# EasyEDA Pro project ProPrj_100MHz��ѹ���̽ͷ_2024-07-25.epro, board 高压差分探头_PLUS_V8.1
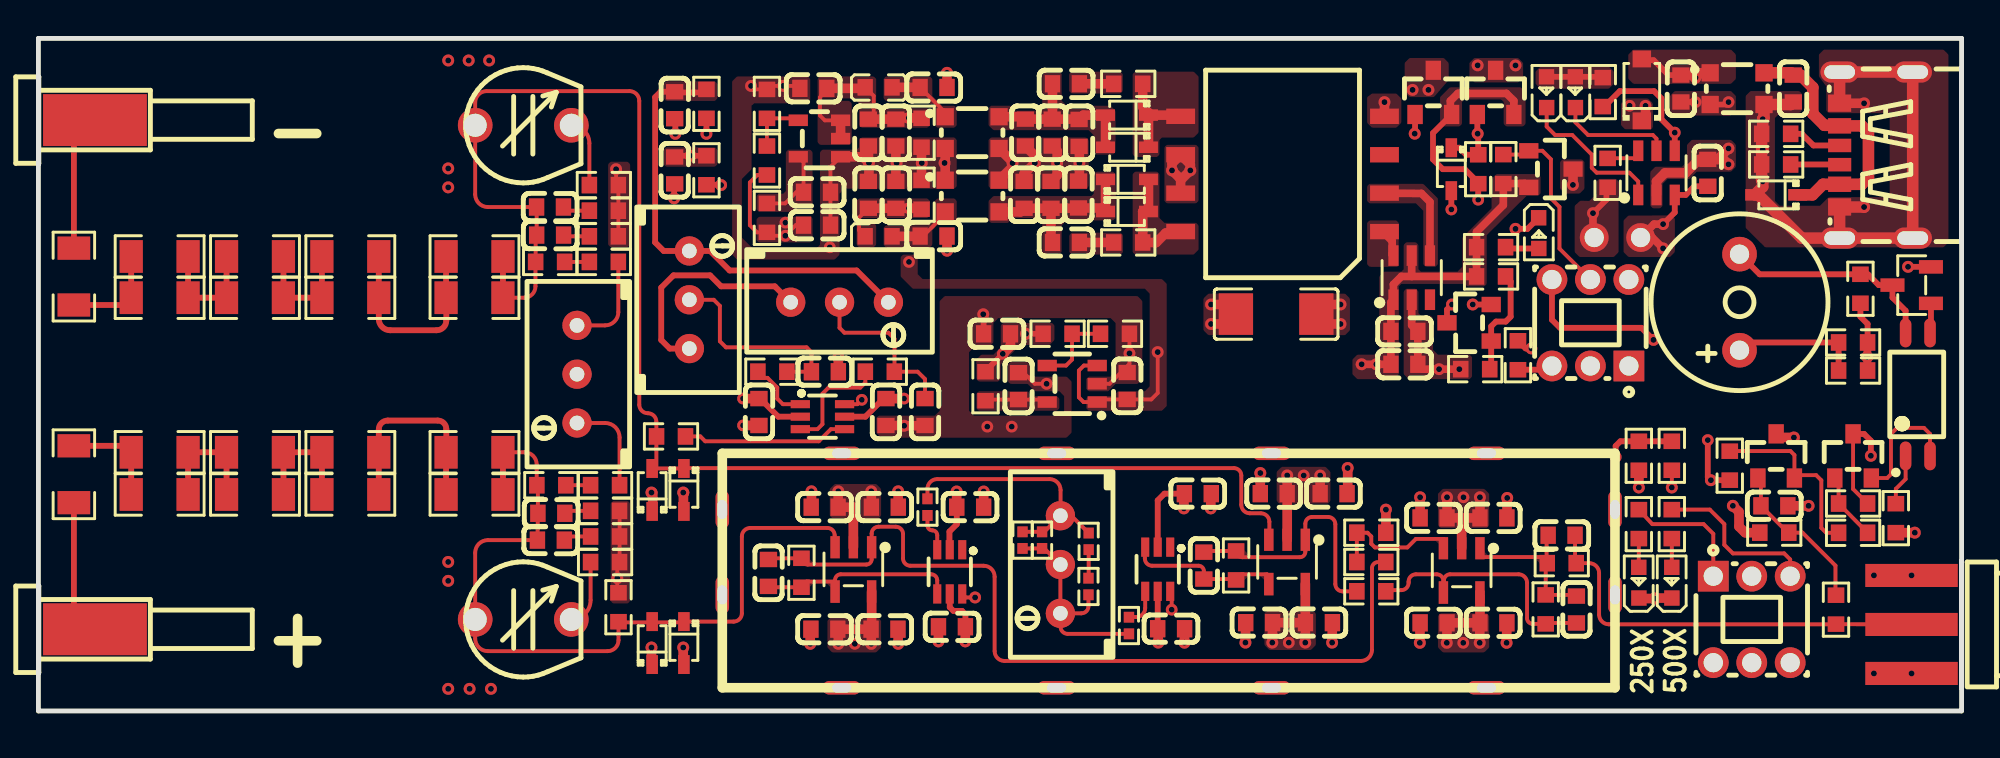
[diagram p12: board, top side]
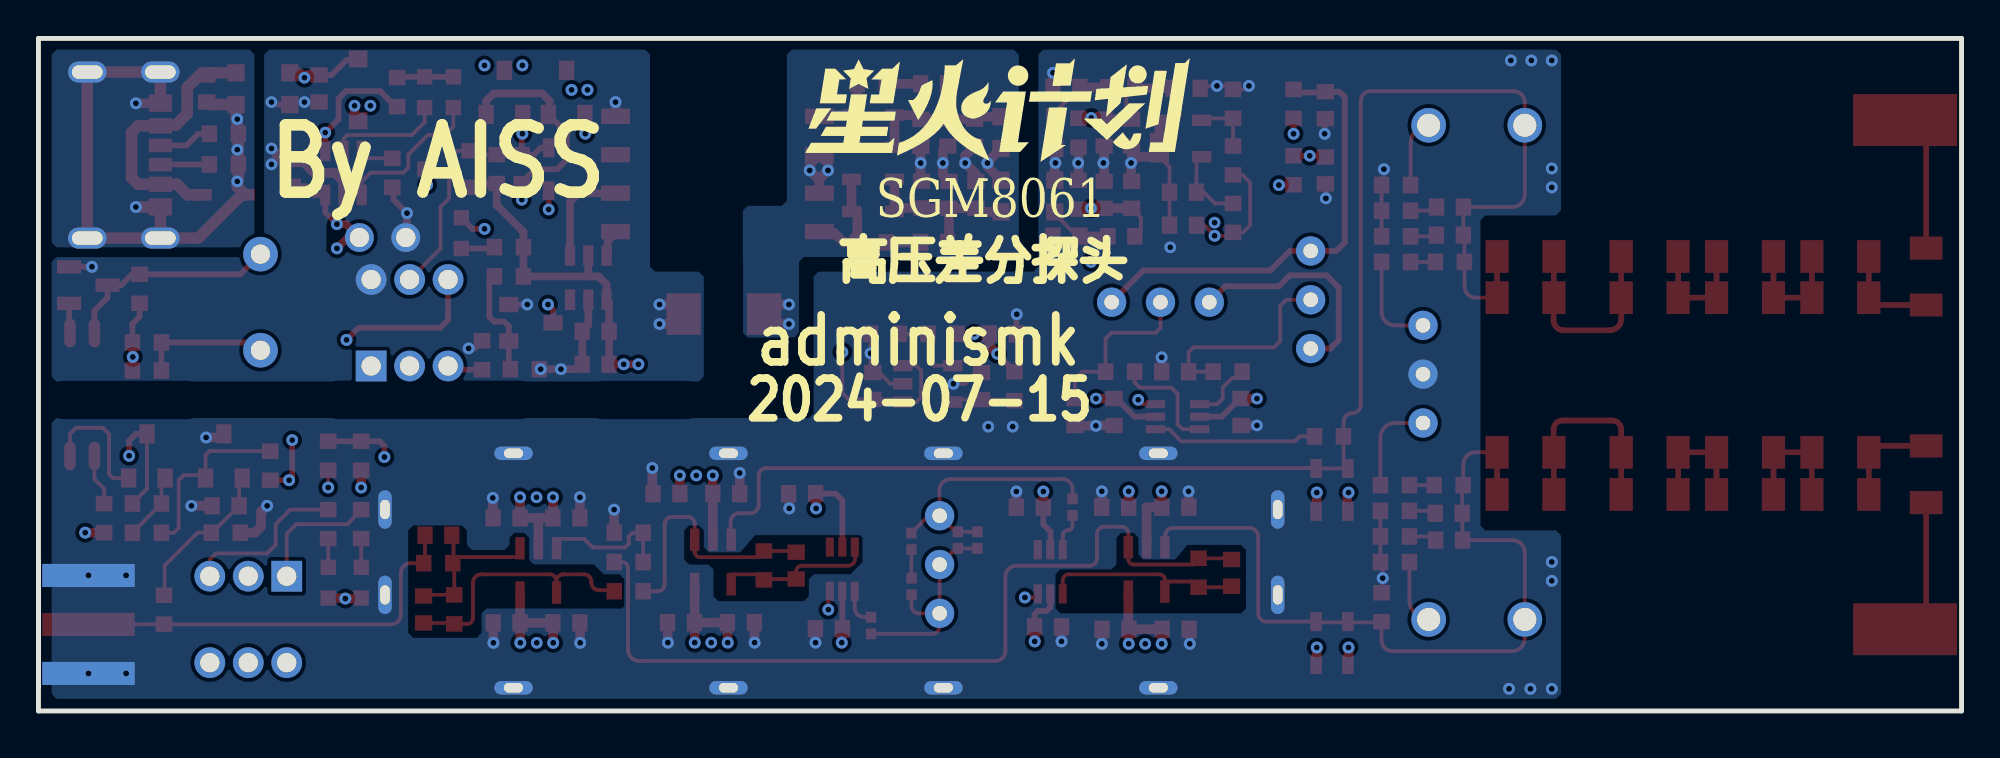
[diagram p13: board, bottom side, seen from below]

Outline 100 x 35 mm; copper layers: Top Layer, Inner1, Inner2, Bottom Layer. Coordinates in mm from the lower left corner of the outline.
Outline path: 0,35 100,35 100,0 0,0 0,35
Stack: Top Layer 0.035mm / Dielectric1 0.48mm PP er 4.5 / Inner1 0.035mm / Dielectric2 0.48mm FR4 er 4.5 / Inner2 0.035mm / Dielectric3 0.48mm PP er 4.5 / Bottom Layer 0.035mm

## Design rules (mm)
template: 用户自定义配置
spacing Default (default): track to track 0.18, other pairs 0 to 0.18
track width Default (default): min 0.099, default 0.099, max 25.4
differential pair differentialPair (default): width min 0.127, default 0.254, max 2.54; gap min 0.152, default 0.152
via Default (default): diameter min 0.61, default 0.61, max 100.025; hole min 0.305, default 0.305, max 59.995
pour e168 uses gge36621

## Placement (name value [footprint] x y rotation side)
BZ1  3kHz  [BUZ-TH_BD9.0-P5.00-D0.6-FD]  88.46 21.27 90 top
C1  22uF  [C0603]  52.65 26.86 270 top
C2  22uF  [C0603]  51.25 26.86 270 top
C3  1uF  [C0603]  44 4.25 180 top
C4  100nF  [C0603]  54.08 26.88 90 top
C5  22uF  [C0603]  43.16 30.1 90 top
C7  22uF  [C0603]  51.32 30.1 90 top
C8  22uF  [C0603]  52.71 30.1 90 top
C9  100nF  [C0603]  40.87 4.25 180 top
C10  10uF  [C0603]  56.61 16.91 270 top
C11  10uF  [C0603]  50.96 16.9 270 top
C12  10uF  [C0603]  49.85 19.63 0 top
C13  100nF  [C0603]  86.8 28 90 top
C14  1nF  [C0603]  53.43 24.38 180 top
C15  10uF  [C0603]  40.29 32.4 0 top
C16  10uF  [C0603]  40.48 27 180 top
C17  10uF  [C0603]  40.48 25.28 180 top
C18  100nF  [C0603]  54.11 30.08 270 top
C19  1nF  [C0603]  53.43 32.64 180 top
C20  10uF  [C0603]  71.03 18.04 180 top
C21  10uF  [C0603]  71.03 19.76 180 top
C22  100nF  [C0603]  33.08 31.52 270 top
C23  100nF  [C0603]  33.08 28.13 270 top
C24  4.7pF  [R1206]  6.3 21.51 180 top
C25  4.7pF  [R1206]  11.26 21.51 180 top
C26  4.7pF  [R1206]  16.22 21.51 180 top
C27  2.2pF  [R1206]  22.67 21.51 180 top
C28  10uF  [C0603]  85.41 32.39 90 top
C29  100nF  [C0603]  40.89 17.65 0 top
C30  100pF  [C0603]  26.61 24.77 180 top
C31  100pF  [C0603]  26.6 26.23 180 top
C32  120pF  [CAP-TH_JML06]  25.21 30.48 0 top
C33  820pF  [C0603]  37.96 7.18 270 top
C34  100pF  [R0402]  51.17 8.89 90 top
C35  NC  [C0603]  79.97 5.28 270 top
C36  220pF  [C0603]  60.6 7.56 270 top
C37  100pF  [C0603]  26.67 10.29 0 top
C38  100pF  [C0603]  26.65 8.89 0 top
C39  120pF  [CAP-TH_JML06]  25.21 4.76 0 top
C40  4.7pF  [R1206]  6.3 13.46 180 top
C41  4.7pF  [R1206]  11.26 13.46 180 top
C42  4.7pF  [R1206]  16.22 13.46 180 top
C43  2.2pF  [R1206]  22.67 13.46 180 top
C44  22pF  [C0603]  79.2 9.14 180 top
C45  2.2pF  [C0603]  90.27 10.68 0 top
C46  1uF  [C0603]  63.48 4.6 0 top
C47  1uF  [C0603]  72.55 4.58 0 top
C48  100nF  [C0603]  66.59 4.6 0 top
C49  100nF  [C0603]  75.66 4.58 0 top
C50  100nF  [C0603]  75.66 10.05 0 top
C51  100nF  [C0603]  67.35 11.31 0 top
C52  1uF  [C0603]  72.55 10.05 0 top
C53  1uF  [C0603]  64.24 11.31 0 top
C54  100nF  [C0603]  44.01 10.6 0 top
C55  1uF  [C0603]  40.88 10.6 0 top
C56  100nF  [C0603]  47.5 4.38 180 top
C57  100nF  [C0603]  48.45 10.6 0 top
C59  22uF  [C0603]  44.59 30.1 90 top
C60  22uF  [C0603]  43.15 26.86 270 top
C61  22uF  [C0603]  44.59 26.86 270 top
C62  100nF  [C0603]  58.9 4.28 0 top
C63  100nF  [C0603]  60.29 11.31 0 top
C64  100nF  [C0603]  44.07 15.56 270 top
C65  100nF  [C0603]  37.47 15.56 270 top
C66  100nF  [C0603]  46.1 15.56 270 top
C67  10uF  [C0603]  91.25 32.39 90 top
C68  22uF  [C0603]  46.55 32.45 180 top
C69  22uF  [C0603]  46.55 24.71 180 top
C70  47pF  [R0402]  54.6 6.48 90 top
D1  PESD5V0S1BA  [SOD-323_L1.7-W1.3-LS2.5-FD-1]  90.36 26.86 0 top
D2  B0520LW  [SOD-123_L2.7-W1.6-LS3.7-RD-4]  83.38 32.32 90 top
D3  B5819WS  [SOD-323_L1.7-W1.3-LS2.5-FD-1]  56.6 27.66 180 top
D4  B5819WS  [SOD-323_L1.7-W1.3-LS2.5-FD-1]  56.6 25.99 180 top
D5  B5819WS  [SOD-323_L1.7-W1.3-LS2.5-FD-1]  73.47 28.19 90 top
D6  B5819WS  [SOD-323_L1.7-W1.3-LS2.5-FD-1]  56.6 31.01 0 top
D7  B5819WS  [SOD-323_L1.7-W1.3-LS2.5-FD-1]  56.6 29.34 0 top
D8  1N4148WS  [SOD-323_L1.7-W1.3-LS2.5-FD-1]  31.91 11.5 270 top
D9  1N4148WS  [SOD-323_L1.7-W1.3-LS2.5-FD-1]  33.56 11.5 90 top
D10  1N4148WS  [SOD-323_L1.7-W1.3-LS2.5-FD-1]  31.91 3.53 270 top
D11  1N4148WS  [SOD-323_L1.7-W1.3-LS2.5-FD-1]  33.56 3.53 90 top
L1  2KΩ  [L0603]  43.69 24.7 180 top
L2  2KΩ  [L0603]  43.69 32.45 180 top
L3  WCM3225F2SF-601T10  [FILTER-SMD_4P-L3.2-W2.5-TL_PCAQ3225A]  88.33 32.39 0 top
L4  WCM3225F2SF-601T10  [FILTER-SMD_4P-L3.2-W2.5-TL_PCAQ3225A]  48.55 26.8 0 top
L5  WCM3225F2SF-601T10  [FILTER-SMD_4P-L3.2-W2.5-TL_PCAQ3225A]  48.55 30.1 0 top
LED1  GREEN  [LED0603-RD_GREEN]  83.22 6.67 90 top
LED2  BLUE  [LED0603-RD]  84.93 6.67 90 top
NOREF  -  [Pad_e7413]  52.94 1.21 0 top
NOREF#2  -  [Pad_e7016]  83.31 24.64 0 top
NOREF#3  -  [Pad_e6879]  52.94 13.41 0 top
NOREF#4  -  [Pad_e6880]  64.12 13.41 0 top
NOREF#5  -  [Pad_e6653]  35.56 10.48 90 top
NOREF#6  -  [Pad_e7151]  75.3 1.21 0 top
NOREF#7  -  [Pad_e7015]  80.9 24.64 0 top
NOREF#8  -  [Pad_e6485]  41.77 1.21 0 top
NOREF#9  -  [Pad_e6514]  41.77 13.41 0 top
NOREF#10  -  [Pad_e7414]  64.12 1.21 0 top
NOREF#11  -  [Pad_e7073]  81.98 10.48 90 top
NOREF#12  -  [Pad_e7037]  81.98 6.04 90 top
NOREF#13  -  [Pad_e7178]  75.3 13.41 0 top
NOREF#14  -  [Pad_e6603]  35.56 6.04 90 top
Q1  SS8050  [SOT-23_L2.9-W1.3-P1.90-LS2.4-BR]  74.39 20.2 0 top
Q2  AO3401A  [SOT-23_L2.9-W1.3-P1.90-LS2.4-BR]  72.53 32.19 270 top
Q3  AO3401A  [SOT-23_L2.9-W1.3-P1.90-LS2.4-BR]  75.77 32.19 270 top
Q4  SS8050  [SOT-23-3_L2.9-W1.3-P1.90-LS2.4-BR]  97.41 22.16 0 top
Q5  S8550  [SOT-23_L2.9-W1.3-P1.90-LS2.4-BR]  94.36 13.27 270 top
Q6  AO3401A  [SOT-23_L2.9-W1.3-P1.90-LS2.4-BR]  78.65 28.2 180 top
R1  1kΩ  [R0603]  75.54 24.14 0 top
R2  330Ω  [R0603]  45.92 26.87 270 top
R3  330Ω  [R0603]  45.92 30.09 90 top
R4  100kΩ  [R0603]  76.17 28.2 270 top
R5  47kΩ  [R0603]  76.93 18.51 270 top
R6  27kΩ  [R0603]  75.54 22.61 180 top
R10  5.1kΩ  [R0603]  90.36 30.04 0 top
R11  5.1kΩ  [R0603]  90.36 28.44 0 top
R12  4.7kΩ  [R0603]  74.71 17.79 0 top
R15  0Ω  [R0603]  49.25 16.9 90 top
R17  120kΩ  [R0603]  52.99 19.63 180 top
R18  110kΩ  [R0603]  55.98 19.63 0 top
R19  4.7kΩ  [R0603]  81.6 28 90 top
R20  100kΩ  [R0603]  74.87 28.19 90 top
R21  22Ω  [R0603]  56.67 24.38 180 top
R23  120kΩ  [R0603]  37.88 28.65 270 top
R24  110kΩ  [R0603]  37.88 31.59 90 top
R27  0Ω  [R0603]  37.88 25.66 270 top
R28  22Ω  [R0603]  56.67 32.64 180 top
R31  10KΩ  [RES-ADJ-TH_3296W]  33.85 21.4 0 top
R33  10kΩ  [R0603]  90.26 9.28 0 top
R34  10kΩ  [R0603]  38.16 17.66 0 top
R35  1MΩ  [R1206]  6.3 23.65 0 top
R36  1MΩ  [R1206]  11.26 23.65 0 top
R37  1MΩ  [R1206]  16.22 23.65 0 top
R38  1MΩ  [R1206]  22.67 23.65 0 top
R39  7.5kΩ  [R0603]  26.61 23.37 180 top
R40  402Ω  [R0603]  69.31 9.28 0 top
R41  402Ω  [R0603]  39.67 7.19 90 top
R42  402Ω  [R0603]  29.4 23.37 180 top
R43  10Ω  [R0603]  29.4 24.7 180 top
R44  10Ω  [R0603]  29.4 26.03 180 top
R45  10Ω  [R0603]  29.4 27.37 180 top
R46  402Ω  [R0603]  69.31 7.75 180 top
R47  50Ω  [R0603]  79.21 7.69 0 top
R48  200Ω  [RES-ADJ-TH_3296W]  28 17.53 180 top
R49  402Ω  [R0603]  69.31 6.23 0 top
R50  3.3kΩ  [R0402]  52.19 8.89 270 top
R52  402Ω  [R0603]  29.46 11.75 0 top
R53  10Ω  [R0603]  29.46 10.41 0 top
R54  10Ω  [R0603]  29.46 9.08 0 top
R55  10Ω  [R0603]  29.46 7.75 0 top
R56  402Ω  [R0603]  62.28 7.57 90 top
R57  20KΩ  [RES-ADJ-TH_3296W]  53.14 7.62 180 top
R58  402Ω  [R0603]  78.38 5.29 90 top
R59  7.5kΩ  [R0603]  26.67 11.75 0 top
R60  NC  [R0603]  30.16 5.4 90 top
R62  1MΩ  [R1206]  6.3 11.27 0 top
R63  1MΩ  [R1206]  11.26 11.27 0 top
R64  1MΩ  [R1206]  16.22 11.27 0 top
R65  1MΩ  [R1206]  22.67 11.27 0 top
R67  2.2kΩ  [R0603]  94.74 21.97 270 top
R68  2.2kΩ  [R0603]  96.58 10.03 270 top
R69  1kΩ  [R0603]  87.95 12.76 270 top
R70  2.2kΩ  [R0603]  83.22 9.72 270 top
R71  1kΩ  [R0603]  94.36 9.27 180 top
R72  2.2kΩ  [R0603]  84.93 9.72 270 top
R73  2.2kΩ  [R0603]  84.93 13.28 270 top
R74  7.5kΩ  [R0603]  93.47 5.27 90 top
R75  2.2kΩ  [R0603]  83.22 13.28 90 top
R76  18kΩ  [R0603]  94.36 10.8 180 top
R77  330kΩ  [R0603]  32.89 14.29 180 top
R78  10KΩ  [RES-ADJ-TH_3296W]  41.66 21.27 270 top
R79  10kΩ  [R0603]  43.75 17.66 0 top
R80  22Ω  [R0603]  34.73 28.14 90 top
R81  22Ω  [R0603]  34.73 31.59 90 top
R82  1kΩ  [R1206]  1.84 22.61 270 top
R83  1kΩ  [R1206]  1.84 12.32 90 top
R84  100Ω  [R0402]  54.61 8.83 270 top
R85  10Ω  [R0402]  46.23 10.61 90 top
R86  10Ω  [R0402]  56.71 4.44 90 top
RF1  BWSMA-KE-P001  [SMA-SMD_BWSMA-KE-P001]  97.4 4.5 0 top
SW1  TK-6580-1  [SW-TH_TK-6580-1]  80.7 20.2 270 top
SW2  TK-6580-1  [SW-TH_TK-6580-1]  89.09 4.76 90 top
U2  BLUE  [LED0603-RD]  78.01 24.87 270 top
U5  1kΩ  [R0603]  81.34 32.21 90 top
U6  RED  [LED0603-RD]  78.42 32.2 90 top
U7  TP4057  [SOT-23-6_L2.9-W1.6-P0.95-LS2.8-BL]  84.14 28 0 top
U8  GREED  [LED0603-RD]  79.92 32.2 90 top
U9  ME6211C25M5G-N  [SOT-23-5_L3.0-W1.7-P0.95-LS2.8-BR]  53.76 17.03 0 top
U10  SGM2209-ADJXN5G/TR  [SOT-23-5_L2.9-W1.6-P0.95-LS2.8-BL]  40.61 29.79 90 top
U11  EPC10  [XFMR-SMD_8P-L10.8-W7.9-P2.00_EPC10]  64.69 27.95 0 top
U14  1nF  [C1808]  64.36 20.65 0 top
U15  SGM8061XN5/TR  [SOT-23-5_L3.0-W1.7-P0.95-LS2.8-BL]  42.38 7.37 180 top
U16  SGM8061XN5/TR  [SOT-23-5_L3.0-W1.7-P0.95-LS2.8-BL]  74.01 7.32 180 top
U17  SGM8061XN5/TR  [SOT-23-5_L3.0-W1.7-P0.95-LS2.8-BL]  64.93 7.75 180 top
U18  200Ω  [R0603]  94.36 19.18 0 top
U19  200Ω  [R0603]  94.36 17.72 0 top
U20  JC3H7C  [OPTO-SMD-4_L4.4-W2.7-P1.27-LS7.0-BR]  97.73 16.47 270 top
U21  BL1551B  [SC-70-6_L2.1-W1.3-P0.65-LS2.3-BR]  47.39 7.24 90 top
U22  TL432  [SOT-23_L2.9-W1.3-P1.90-LS2.4-BR]  90.36 13.27 270 top
U23  VPS8702  [SOT-23-6_L2.9-W1.6-P0.95-LS2.8-BL]  71.41 22.55 0 top
U24  2mm香蕉头  [2MM香蕉头母座]  4.97 30.75 0 top
U25  2mm香蕉头  [2MM香蕉头母座]  4.97 4.25 0 top
U26  BL1551B  [SC-70-6_L2.1-W1.3-P0.65-LS2.3-BR]  58.2 7.37 90 top
U27  BL1551B  [SC-70-6_L2.1-W1.3-P0.65-LS2.3-BR]  40.77 15.31 180 top
USBC1  USB 3.1 C 6PF  [USB-C-SMD_TYPE-C-USB-13]  95.56 28.93 90 top

## Footprints (pads in the part's own frame, mm; a bottom-side part is the same pattern mirrored in y, then rotated)
2MM香蕉头母座
  rect 5.4x2.7 smd: 1(-2.032,0)
BUZ-TH_BD9.0-P5.00-D0.6-FD
  round 1.8 hole 1: 1(-2.5,0) 2(2.5,0)
C0603
  rect 0.8x0.9 smd: 1(-0.7,0) 2(0.7,0)
C1808
  rect 1.785x2.16 smd: 1(-2.092,0) 2(2.092,0)
CAP-TH_JML06
  round 1.8 hole 1.2: 1(-2.5,0) 2(2.5,0)
FILTER-SMD_4P-L3.2-W2.5-TL_PCAQ3225A
  rect 0.9x0.9 smd: 1(-1.4,0.825) 2(1.4,0.825) 3(1.4,-0.825) 4(-1.4,-0.825)
L0603
  rect 0.8x0.864 smd: 1(-0.7,0) 2(0.7,0)
LED0603-RD
  rect 0.8x0.8 smd: 1(-0.799,-0.004) 2(0.799,0.004)
LED0603-RD_GREEN
  rect 0.8x0.8 smd: 1(-0.799,-0.004) 2(0.799,0.004)
OPTO-SMD-4_L4.4-W2.7-P1.27-LS7.0-BR
  oval 1.5x0.6 smd: 1(3.2,-0.635) 2(3.2,0.635) 3(-3.2,0.635) 4(-3.2,-0.635)
Pad_e6485
  oval 2x0.7 hole 1x0.5: 2(0,0)
Pad_e6514
  oval 2x0.7 hole 1x0.5: 2(0,0)
Pad_e6603
  oval 2x0.7 hole 1x0.5: 2(0,0)
Pad_e6653
  oval 2x0.7 hole 1x0.5: 2(0,0)
Pad_e6879
  oval 2x0.7 hole 1x0.5: 2(0,0)
Pad_e6880
  oval 2x0.7 hole 1x0.5: 2(0,0)
Pad_e7015
  round 1.5 hole 1: 1(0,0)
Pad_e7016
  round 1.5 hole 1: 1(0,0)
Pad_e7037
  oval 2x0.7 hole 1x0.5: 2(0,0)
Pad_e7073
  oval 2x0.7 hole 1x0.5: 2(0,0)
Pad_e7151
  oval 2x0.7 hole 1x0.5: 2(0,0)
Pad_e7178
  oval 2x0.7 hole 1x0.5: 2(0,0)
Pad_e7413
  oval 2x0.7 hole 1x0.5: 2(0,0)
Pad_e7414
  oval 2x0.7 hole 1x0.5: 2(0,0)
R0402
  rect 0.566x0.54 smd: 1(-0.433,0) 2(0.433,0)
R0603
  rect 0.806x0.864 smd: 1(-0.753,0) 2(0.753,0)
R1206
  rect 1.208x1.701 smd: 1(-1.479,0) 2(1.479,0)
RES-ADJ-TH_3296W
  round 1.524 hole 0.762: 1(0,2.54) 2(0,0) 3(0,-2.54)
SC-70-6_L2.1-W1.3-P0.65-LS2.3-BR
  rect 1x0.42 smd: 1(1.15,-0.65) 2(1.15,0) 3(1.15,0.65) 4(-1.15,0.65) 5(-1.15,0) 6(-1.15,-0.65)
SMA-SMD_BWSMA-KE-P001
  rect 4.8x1.2 smd: 1(0,-2.55) 2(0,2.55) 5(0,0)
  rect 4.8x1.2 smd far side: 3(0,2.55) 4(0,-2.55)
SOD-123_L2.7-W1.6-LS3.7-RD-4
  rect 0.88x0.96 smd: 1(-1.61,0) 2(1.61,0)
SOD-323_L1.7-W1.3-LS2.5-FD-1
  rect 0.985x0.6 smd: 1(-1.117,0) 2(1.117,0)
SOT-23-3_L2.9-W1.3-P1.90-LS2.4-BR
  rect 1.25x0.7 smd: 1(1,-0.95) 2(1,0.95) 3(-1,0)
SOT-23-5_L2.9-W1.6-P0.95-LS2.8-BL
  rect 0.6x1 smd: 1(-0.95,-1.1) 2(0,-1.1) 3(0.95,-1.1) 4(0.95,1.1) 5(-0.95,1.1)
SOT-23-5_L3.0-W1.7-P0.95-LS2.8-BL
  rect 0.49x1.157 smd: 1(-0.95,-1.153) 2(0,-1.153) 3(0.95,-1.153)
  rect 0.49x1.175 smd: 4(0.95,1.153) 5(-0.95,1.153)
SOT-23-5_L3.0-W1.7-P0.95-LS2.8-BR
  rect 1x0.6 smd: 1(1.3,-0.95) 2(1.3,0) 3(1.3,0.95) 4(-1.3,0.95) 5(-1.3,-0.95)
SOT-23-6_L2.9-W1.6-P0.95-LS2.8-BL
  rect 0.532x1.072 smd: 1(-0.95,-1.149) 2(0,-1.149) 3(0.95,-1.149) 4(0.95,1.149) 5(0,1.149) 6(-0.95,1.149)
SOT-23_L2.9-W1.3-P1.90-LS2.4-BR
  rect 1x0.8 smd: 1(1.15,-0.95) 2(1.15,0.95) 3(-1.15,0)
SW-TH_TK-6580-1
  rect 1.6x1.6 hole 1: 1(2.25,2)
  round 1.6 hole 1: 2(2.25,0) 3(2.25,-2) 4(-2.25,2) 5(-2.25,0) 6(-2.25,-2)
USB-C-SMD_TYPE-C-USB-13
  oval 1.1x2 hole 0.7x1.6: 1(-4.32,1.899) 2(-4.32,-1.901) 3(4.32,-1.901) 4(4.32,1.899)
  rect 0.7x1.2 smd: A5(-0.5,1.897) B5(0.5,1.897)
  rect 0.8x1.2 smd: A9(-1.52,1.899) B9(1.52,1.901)
  rect 0.9x1.2 smd: A12(-2.7,1.899) B12(2.7,1.899)
XFMR-SMD_8P-L10.8-W7.9-P2.00_EPC10
  rect 1.5x0.8 smd: 1(5.3,-3) 2(5.3,-1) 3(5.3,1) 4(5.3,3) 5(-5.3,3) 6(-5.3,1) 7(-5.3,-1) 8(-5.3,-3)

## Nets
As in the schematic, except:
GND: C3.1 C5.1 C9.2 C10.1 C11.1 C12.1 C15.1 C16.1 C17.1 C22.2 C23.2 C29.2 C45.2 C46.1 C47.1 C48.2 C49.2 C50.2 C51.2 C52.1 C53.1 C54.2 C55.1 C56.2 C57.2 C59.1 C60.1 C61.1 C62.2 C63.2 C64.2 C65.2 C66.2 C68.1 C69.1 L4.1 L5.4 NOREF.2 NOREF#3.2 NOREF#4.2 NOREF#5.2 NOREF#6.2 NOREF#8.2 NOREF#9.2 NOREF#10.2 NOREF#11.2 NOREF#12.2 NOREF#13.2 NOREF#14.2 R2.1 R3.1 R18.2 R24.2 R33.1 R40.2 R43.1 R44.1 R45.1 R48.2 R53.2 R54.2 R55.2 R60.2 RF1.1 RF1.2 RF1.3 RF1.4 U9.2 U10.1 U22.3
PGND: C13.2 C20.1 C21.1 C28.1 L3.4 NOREF#7.1 Q1.2 Q4.2 R5.1 R12.1 R19.1 SW1.4 U7.2 U11.4 U14.2 U23.2
BAT+: C13.1 NOREF#2.1 Q2.3 U7.3

Pads without a net: SW1 1; U11 3; U21 1; U23 3; U26 1

## Via types
v1: diameter 0.62, hole 0.31, Top Layer to Bottom Layer, 117 vias
v2: diameter 0.61, hole 0.305, Top Layer to Bottom Layer, 34 vias

## Routing (per net, layer and track width the routed paths; a pad name or vN(x,y) marks a point on that pad's centre or on a via; arc(x,y) is an arc through that point)
+2.5V: length 164.9
  Top Layer w0.3: v1(51.35,19.63) R17.2 ; R15.2 49.25,17.69 v2(50.14,18.58) ; v1(35.5,27.37) 35.48,27.39 R80.1 ; 44.07,16.19 43.88,16.19 43,15.31 U27.5 ; U21.5 47.39,5.4 47.58,5.21 48.02,5.21 48.2,5.03 C56.1 ; U26.5 58.2,4.28
  Top Layer w0.5: 73.23,3.55 73.25,4.58 74.96,4.58 74.94,3.55 ; C3.2 C9.1 41.59,4.23 v1(41.59,3.49) ; U16.5 74.96,4.58 ; C12.2 50.55,18.99 v2(50.14,18.58) ; v1(64.16,3.56) 64.17,4.59 65.89,4.59 v1(65.87,3.56) ; 31.94,11.37 31.94,10.55 ; C48.1 65.88,4.61 U17.5 ; C62.1 58.23,4.25 v1(58.23,3.56) ; v1(48.2,3.62) 48.2,4.38 C56.1 ; v1(31.88,3.3) 31.88,2.38 ; U15.5 43.32,4.25 ; v1(43.31,3.49) 43.31,4.24 ; v2(45.01,16.26) 44.07,16.26
  Inner2 w0.5: 32.64,27.75 31.88,26.99 v1(31.88,11.37) v1(31.88,3.3) 31.88,2.6 32.19,2.29 40.39,2.29 v1(41.59,3.49) v2(42.45,3.49) v1(43.31,3.49) 44.32,2.48 47.06,2.48 v1(48.2,3.62) 49.34,2.48 57.15,2.48 v1(58.23,3.56) 59.31,2.48 63.08,2.48 v1(64.16,3.56) v2(65.02,3.56) v1(65.87,3.56) 66.95,2.48 72.16,2.48 v1(73.23,3.55) v2(74.09,3.55) v1(74.94,3.55) 75.98,2.51 SW2.4 SW2.5 ; 32.64,27.75 35.12,27.75 v1(35.5,27.37) ; 32.64,27.75 31.69,28.7 31.69,32.58 32.58,33.46 40.39,33.46 40.96,32.89 40.96,26.03 42.93,24.07 42.93,20.38 43.31,20 44.52,20 45.02,19.5 45.02,16.27 v2(45.01,16.26) 49.78,16.26 50.16,16.64 50.16,18.56 v2(50.14,18.58) 51.19,19.63 v1(51.35,19.63)
+4.5V: length 72.9
  Top Layer w0.2: C60.2 42.67,25.68 42.67,25.02 L1.2 ; v1(58.2,18.68) 58.2,16.54 57.87,16.21 C10.2 55.19,16.21 U9.1 ; 55.05,17.98 54.36,17.98 54.1,17.72 54.1,16.32 54.35,16.08 55.05,16.08
  Top Layer w0.3: 87.95,12.01 86.97,12.01 ; v1(86.97,12.01) 86.8,12.17 v2(86.8,14.1)
  Top Layer w0.5: 97.57,9.28 96.58,9.28 ; C60.2 C61.2 v2(45.27,26.16) 45.87,26.16 45.92,26.11
  Inner2 w0.3: 86.97,12.01 88.32,12.01 89.06,11.27 89.06,7.04 SW2.2 90.44,5.66 97.61,5.66 98.2,6.25 98.2,8.65 97.57,9.28 ; v2(86.8,14.1) 86.17,14.73 58.61,14.73 58.2,15.14 v1(58.2,18.68)
  Inner2 w0.5: v2(45.27,26.16) v2(45.27,23.37)
  vias: v1(97.57,9.28)
+5V: length 71.8
  Top Layer w0.3: v1(83.98,19.31) 83.35,19.94 79.12,19.94 78.7,20.36 78.7,22.45 ; R67.2 94.74,20.51 95.11,20.14 U18.2
  Top Layer w0.4: U23.5 71.41,22.61 ; 71.41,22.61 70.87,22.61 70.46,22.2 70.46,21.4 ; 71.41,22.61 R6.2 R1.1 74.78,24.94 76.17,26.32 R4.2 77.3,27.45 Q6.2 ; U23.1 70.33,21.27 C21.2 C20.2 v1(69.57,18.04) ; 95.12,17.72 95.09,18.42 95.12,19.18 ; v1(68.81,18.04) 69.38,18.04
  Top Layer w0.5: D2.1 83.57,30.9 v2(83.57,31.5)
  Inner2 w0.3: v1(83.98,19.31) 85.82,17.47 90.01,17.47 90.97,18.42 v1(95.09,18.42)
  Inner2 w0.5: v1(95.09,18.42) 95.09,20.79 94.62,21.27 87.57,21.27 87,21.84 87,33.53 86.49,34.04 84.14,34.04 83.57,33.46 v2(83.57,31.5) v2(82.74,31.5)
  vias: v1(74.84,33.6) v1(76.81,33.6)
+VCC: length 9.2
  Top Layer w0.5: C1.2 54.07,26.16 C4.1 55.3,26.18 D4.2 D3.2 ; C1.2 C2.2 51.07,25.97 L4.3 ; C1.2 52.65,24.46 C14.2
-2.5V: length 137.2
  Top Layer w0.2: 37.88,24.91 38.06,24.73 v1(38.84,24.73) 38.84,24.74 39.38,25.28 C17.2 ; R27.2 37.36,24.91 36.99,25.28 36.99,27.5 37.38,27.89 37.88,27.89
  Top Layer w0.3: U27.2 38.47,15.31 37.59,16.19 37.47,16.19 ; C63.1 58.55,11.31 58.2,10.96 U26.2 ; v1(34.73,30.04) 34.73,30.74 ; C57.1 47.75,9.71 47.37,9.33 47.37,8.41 47.39,8.39
  Top Layer w0.5: 66.65,11.31 v2(66.65,12.26) ; C63.1 59.56,11.28 v1(59.56,10.54) ; 64.94,8.92 C53.2 64.94,12.25 ; 83.22,12.52 v1(83.22,11.63) ; v1(41.59,11.43) 41.58,11.42 C55.2 42.38,10.6 U15.2 ; C54.1 43.31,11.43 v1(43.31,11.43) ; v1(33.53,3.3) 33.53,2.38 ; 37.46,16.26 v2(36.64,16.26) ; C57.1 47.74,10.61 v1(47.74,11.42) ; v1(74.96,11.12) 74.96,10.05 74.07,10.05 74.01,9.98 ; 33.59,11.37 33.54,11.31 33.54,10.62 33.59,10.57 ; 74.01,8.47 74.01,9.98 ; 74.01,9.98 73.94,10.05 73.25,10.05 v1(73.24,11.12)
  Inner2 w0.5: v1(83.22,11.63) 82.84,12.01 75.82,12.01 74.96,11.15 v1(74.96,11.12) v2(74.1,11.12) v1(73.25,11.12) 72.43,11.94 69.02,11.94 68.58,11.49 67.41,11.49 v2(66.65,12.26) v2(65.79,12.26) v1(64.93,12.26) 64.17,11.49 60.52,11.49 v1(59.56,10.54) 57.72,12.38 48.7,12.38 47.74,11.42 47.74,11.44 46.93,12.26 43.94,12.26 43.81,12.13 ; 36.64,17.46 43.24,17.46 43.81,16.89 43.81,12.13 ; 36.64,17.46 v2(36.64,16.26) ; 36.64,17.46 36.64,24.07 37.27,24.7 38.81,24.7 v1(38.84,24.73) v2(38.84,25.41) 38.84,29.36 38.16,30.04 v1(34.73,30.04) ; v2(36.64,16.26) 34.04,16.26 33.53,15.75 v1(33.53,11.37) ; v2(36.64,16.26) 38.67,16.26 39.18,15.75 39.18,10.99 39.62,10.54 40.7,10.54 v1(41.59,11.43) ; v1(43.31,11.43) 43.81,11.94 43.81,12.13 ; 33.59,11.37 33.59,3.37 v1(33.53,3.3)
-4.5V: length 109.2
  Top Layer w0.2: R76.1 94.36,11.55 Q5.3 ; C5.2 43.43,31.07 43.43,32.01 L2.2 ; 41.71,30.74 41.71,30.73 40.89,30.73 40.64,30.99 40.64,31.94 40.99,32.29 C15.2
  Top Layer w0.3: v1(95.28,13.28) 95.28,14.06 94.93,14.41 94.37,14.41 Q5.3
  Top Layer w0.5: LED1.1 83.25,5.85 84.05,5.85 84.07,5.88 LED2.1 ; R3.2 45.9,30.86 v2(45.26,30.86) 44.65,30.86 C59.2 C5.2 ; C15.2 42.93,32.4 L2.2 ; 41.71,30.74 41.71,29.79
  Inner2 w0.3: 84.05,5.85 84.88,5.02 97.82,5.02 98.78,5.98 98.78,12.77 98.27,13.28 84.89,13.28 84.01,14.16 58.23,14.16 57.47,14.92 57.47,21.72 56.9,22.29 47.05,22.29 46.48,22.86 46.48,26.61 45.28,27.81 45.28,30.84 v2(45.26,30.86)
  vias: v1(84.04,5.85)
-VCC: length 9.2
  Top Layer w0.5: C8.2 52.73,30.81 C19.2 ; C8.2 C7.2 51.19,30.92 L5.2 ; C8.2 54.1,30.8 C18.1 54.34,31.01 D6.1 D7.1
GND: length 56.7
  Top Layer w0.2: v1(37.06,32.53) 37.23,32.35 37.88,32.35 38.06,32.53 v1(38.72,32.53) 39.47,32.53 C15.1 ; 30.16,24.7 30.16,27.37 30.04,27.49 v1(30.04,28.19) ; R18.2 v1(56.73,18.61) 56.73,18.06 55.7,17.03 U9.2 ; R60.2 30.1,6.22 v1(30.1,6.91) 30.1,7.63 R55.2 R54.2 R53.2 ; C11.1 51.23,17.6 51.81,17.03 v1(52.42,17.03) ; 41.71,28.84 41.18,28.31 C16.1 C17.1
  Top Layer w0.3: C12.1 49.15,20.63 v1(49.13,20.64) ; C23.2 33.05,27.4 v1(33.05,26.68) ; 33.08,30.79 33.12,30.75 v1(33.12,30.04)
  Top Layer w0.5: v1(71.84,11.12) 71.84,10.05 71.85,10.05 ; v1(67.27,3.56) C48.2 ; C45.2 v1(92.05,10.68) ; v1(68.08,12.64) 68.08,11.31 68.05,11.31 ; C66.2 46.09,14.84 45.07,14.84 45.06,14.86 C64.2 ; v1(47.24,33.21) 47.24,32.45 ; 44.7,11.37 44.7,10.61 44.71,10.6 ; 43.16,28.55 v1(43.19,28.52) 43.19,27.59 C60.1 ; 43.16,28.55 42.87,28.84 41.71,28.84 ; 43.16,28.55 C5.1 ; R3.1 45.92,28.53 v1(45.93,28.52) 45.92,28.5 R2.1 ; v1(41.59,18.4) C29.2 ; v1(59.59,3.55) 59.59,4.27 ; v1(91.28,14.23) 90.4,14.23 90.36,14.27 ; C61.1 44.59,28.48 v1(44.62,28.52) 44.59,28.56 C59.1 ; 71.84,4.58 71.83,3.55 ; C3.1 44.7,4.25 v1(44.7,3.49) ; C50.2 76.37,11.08 ; R40.2 70.07,9.28 v1(70.07,10.48) ; v1(49.15,11.42) C57.2 ; v1(46.8,3.62) 46.8,4.38 ; v1(47.25,23.95) C69.1 ; v1(40.2,11.43) 40.2,10.62 ; v1(63.54,12.38) 63.53,11.31 ; v2(36.64,14.86) 37.46,14.86 ; v1(62.76,3.56) 62.77,4.59 ; R33.1 88.75,9.28 88.43,9.6 88.43,10.36 88.11,10.68 ; 40.17,4.25 40.13,4.22 v1(40.13,3.49) ; 76.36,4.58 76.34,3.55 ; L4.1 47.15,28.49 v1(47.12,28.52) 47.15,28.55 L5.4 ; 60.99,11.31 C63.2 60.96,11.28 v1(60.96,10.54)
  vias: v1(21.31,33.85) v1(21.31,28.23) v1(21.31,27.25) v1(21.31,7.75) v1(21.31,6.77) v1(21.31,1.15) v1(22.37,33.85) v1(22.42,1.15) v1(23.43,33.85) v1(23.53,1.15) v1(44.7,11.43) v1(45.01,14.84) v1(71.83,3.55) v1(76.34,3.55) v1(76.37,11.09) v1(88.11,10.68) v1(95.44,7.06) v1(95.44,1.95) v1(97.4,7.06) v1(97.4,1.95) v2(41.15,24.13) v2(49.34,14.8) v2(50.61,14.8)
PGND: length 24
  Top Layer w0.3: v1(77.63,18.87) 77.33,18.87 76.93,19.27 ; Q1.2 74.59,21.15 v1(74.58,21.15) ; L3.4 87.76,31.56 v2(87.88,31.69) ; v1(97.22,23.11) 98.41,23.11 Q4.2 ; 81.53,27.24 81.53,26.61 v1(80.84,25.91) ; v2(86.17,31.69) 86.16,31.69 C28.1
  Top Layer w0.4: NOREF#7.1 80.84,24.7 v1(80.84,25.91) ; 73.95,17.79 v1(72.83,17.79) 71.98,17.79 C20.1 C21.1 71.41,20.08 U23.2
  Top Layer w0.5: U7.2 84.14,27.56 84.58,28 85.66,28 86.36,28.7 C13.2 87.31,28.7 ; v1(67.71,20.14) 66.47,20.14 65.95,20.65 66.45,21.15 v1(67.71,21.15) ; v2(87.88,28.45) 87.63,28.7 87.31,28.7 ; 87.31,28.7 v2(87.88,29.27) ; v1(69.99,31.69) 69.99,30.95 ; 73.95,17.79 73.96,17.79
  vias: v1(73.88,17.79)
SGND: length 16.5
  Top Layer w0.5: C7.1 51.81,28.91 v1(51.81,28.52) 51.25,27.96 C2.1 ; 59.39,27.63 v1(59.9,28.13) 59.9,28.44 U11.6 58.94,28.5 v1(58.94,28.13) 59.39,27.68 59.39,27.63 ; 59.39,27.63 U11.7 ; C18.2 54.13,29.37 v1(54.13,28.52) 54.13,27.62 C4.2 ; C1.1 52.97,27.88 v1(52.97,28.52) 52.97,29.14 C8.1 ; L4.2 50.65,28.33 v1(50.65,28.52) 50.65,28.57 L5.3 ; v1(60.98,20.14) 62.25,20.14 62.77,20.65 62.27,21.15 v1(60.98,21.15)
VBUS: length 38.2
  Top Layer w0.3: 83.38,33.87 83.99,33.87 84.76,33.09 C28.2 ; D5.1 v2(73.47,26.1)
  Top Layer w0.5: C28.2 86.03,33.09 v2(86.17,32.96) 86.42,33.21 L3.1
  Inner2 w0.3: v2(73.47,26.1) 72.58,25.21 72.58,20.64 72.96,20.26 85.79,20.26 86.23,20.7 86.23,30.29 85.22,31.31 85.22,32.58 85.6,32.96 v2(86.17,32.96)
VCC_BIAS: length 31.2
  Top Layer w0.3: R80.2 v2(33.9,28.89) 33.14,28.89 C23.1 ; R78.3 38.29,22.1 35.5,22.1 34.93,22.67 33.02,22.67 32.38,22.03 32.38,19.3 32.83,18.86 R31.3
  Inner2 w0.3: v2(33.9,28.89) 33.9,30.72 34.29,31.11 39.18,31.11 39.69,30.61 39.69,23.3 39.12,22.73 R78.3
VSS_BIAS: length 23.8
  Top Layer w0.3: 33.08,32.19 34.67,32.19 34.73,32.25 ; C22.1 32.35,32.22 32.07,31.94 32.07,24.38 32.51,23.94 R31.1 34.93,23.94 35.94,22.92 42.54,22.92 R78.1
50X_BIAS_IN: length 5.9
  Top Layer w0.2: R79.1 43,17.09 42.74,16.83 41.08,16.83 40.77,16.51 40.77,14.92 40.51,14.67 U27.3
500X_BIAS_IN: length 3.2
  Top Layer w0.2: U27.1 38.71,15.97 38.42,16.26 38.42,16.83 37.91,17.34 37.73,17.34 R34.1
BAT+: length 6.5
  Top Layer w0.3: C13.1 86.11,27.31 85.66,26.85 U7.3 85.09,25.94 v1(84.48,25.34)
  Top Layer w0.4: v1(84.48,24.07) 83.92,24.64 NOREF#2.1 84.01,25.34 v1(84.48,25.34)
  vias: v1(71.45,32.32) v1(72.28,32.32)
BAT_CHRG: length 32.1
  Top Layer w0.3: U5.1 81.43,31.45 82.23,32.26 84.01,32.26 84.39,31.88 84.39,30.8 v2(85.09,30.1) U7.4
  Top Layer w0.5: Q6.3 79.8,27.38 v1(79.79,27.38)
  Inner2 w0.5: v2(85.09,30.1) 85.53,29.65 85.53,21.72 84.84,21.02 77.47,21.02 76.9,21.59 76.9,23.5 79.79,26.39 v1(79.79,27.38)
BIAS_OUT: length 8.6
  Top Layer w0.2: U27.4 41.21,14.67 40.58,14.03 34.67,14.03 34.42,14.29 R77.1
EGND: length 33.9
  Top Layer w0.5: v1(94.93,31.62) USBC1.B12
  Top Layer w0.6: USBC1.B12 93.66,33.25 USBC1.3 USBC1.2 93.66,24.61 ; 93.66,24.61 93.66,26.23 93.66,26.23 v1(94.93,26.23) ; 93.66,24.61 91.69,24.61 89.44,26.86 D1.1 89.66,27.28 v2(89.66,27.56) 89.61,27.61 R11.1 89.61,29.16 v2(89.66,29.21) 89.61,29.27 R10.1 89.66,30.09 v2(89.66,30.8) 89.73,30.86 L3.3 91.12,31.56 C67.1
HV_IN+: length 41.9
  Top Layer w0.2: C43.1 25.27,13.46 arc(25.72,13.28) 25.91,12.83 25.91,11.76 arc(25.91,11.75) R59.1 ; 30.2,4.61 33.53,4.61 ; D11.2 36.15,4.65 arc(36.45,4.78) 36.58,5.08 36.58,9.08 arc(36.71,9.39) 37.02,9.53 41.02,9.53 arc(41.29,9.41) 41.4,9.14 41.4,8.54 U15.3 ; R60.1 30.16,3.68 arc(30,3.28) 29.59,3.11 23.37,3.11 arc(22.9,3.3) 22.71,3.77 C39.1 22.71,8.23 arc(22.9,8.7) 23.37,8.89 C38.1 25.97,10.29 25.97,11.69
  Top Layer w0.3: 24.15,11.27 24.15,13.46
HV_IN-: length 80.6
  Top Layer w0.2: 32.13,14.29 32.13,12.65 arc(32.12,12.63) 32.1,12.62 33.75,12.62 ; 33.75,12.62 33.77,12.64 62.17,12.64 arc(62.44,12.52) 62.55,12.26 62.55,10.73 arc(62.68,10.42) 62.99,10.29 63.56,10.29 arc(63.88,10.16) 64.01,9.84 64.01,8.94 arc(64,8.92) U17.3 ; C27.1 25.25,21.51 arc(25.67,21.68) 25.84,22.1 25.84,23.36 arc(25.85,23.37) R39.2 25.85,24.71 arc(25.87,24.75) C30.2 25.91,26.22 arc(25.91,26.22) C31.2 23.37,26.23 arc(22.9,26.42) 22.71,26.88 C32.1 22.71,31.66 arc(22.88,32.08) 23.3,32.26 30.73,32.26 arc(31.09,32.11) 31.24,31.75 31.24,15.94 arc(31.37,15.62) 31.69,15.49 arc(32,15.36) 32.13,15.05 32.13,14.3 arc(32.13,14.29) R77.2
  Top Layer w0.3: C27.1 R38.2
POWER_IN: length 13.9
  Top Layer w0.6: 93.66,27.41 92.8,27.41 92.25,26.86 D1.2 ; 93.66,27.41 94.81,27.41 95.16,27.76 95.16,30.11 94.82,30.45 93.66,30.45 93.63,30.48 92.87,30.48 92.27,31.08 92.27,32.45 91.62,33.09 C67.2 91.13,33.21 L3.2
SET_EN: length 73
  Top Layer w0.2: U26.6 58.93,6.15 v2(58.93,5.27) ; v1(48.7,5.91) 48.22,5.91 48.04,6.09 ; v2(42.81,16.19) 42.59,15.97 U27.6
  Top Layer w0.3: 84.94,14.03 82.26,14.03 82.01,13.79 82.01,13.22
  Inner2 w0.2: v2(42.81,16.19) 40.58,16.19 40.2,15.81 40.2,13.02 40.58,12.64 42.04,12.64 42.42,12.26 42.42,10.22 42.83,9.81 48.29,9.81 48.7,9.4 v1(48.7,5.91) 49.78,5.91 50.23,6.35 58.61,6.35 58.93,6.03 v2(58.93,5.27) 67.63,5.27 67.94,5.59 67.94,9.4 68.39,9.84 80.9,9.84 81.72,9.02 82.99,9.02 84.2,10.22 84.2,12.7 83.69,13.22 82.01,13.22
  vias: v1(82.01,13.22)
SIGNAL_A: length 10.6
  Top Layer w0.2: C33.2 38.01,6.44 R41.1 39.67,6.46 39.94,6.73 41.34,6.73 41.43,6.64 ; 41.43,6.64 41.43,6.82 arc(41.51,7.03) 41.72,7.11 46.42,7.11 arc(46.64,7.02) 46.74,6.79 46.74,6.09 ; 41.43,6.64 U15.4
SIGNAL_B: length 2.1
  Top Layer w0.2: 46.74,8.39 46.74,9.14 arc(46.66,9.32) 46.48,9.4 arc(46.3,9.47) 46.23,9.65 R85.1
SIGNAL_C: length 2
  Top Layer w0.2: U26.4 57.55,5.35 arc(57.41,5.03) 57.09,4.89 56.72,4.89 arc(56.71,4.89) R86.2
SIGNAL_D: length 8.4
  Top Layer w0.2: U17.4 63.98,7.02 63.88,7.11 62.57,7.11 R56.1 62.23,6.86 C36.2 60.6,7.28 arc(60.52,7.48) 60.32,7.56 57.91,7.56 arc(57.64,7.67) 57.53,7.94 57.53,8.5 arc(57.54,8.52) U26.3
SIGNAL_OUT: length 21.7
  Top Layer w0.2: C44.1 79.9,7.75 R47.2 80.64,7.69 arc(81,7.54) 81.15,7.18 81.15,5.02 arc(81.3,4.66) 81.66,4.51 93.46,4.51 arc(93.47,4.51) R74.1 RF1.5
$1N9: length 2.8
  Top Layer w0.3: R10.2 91.69,30.04 92.3,29.43 USBC1.B5
$1N10: length 2.6
  Top Layer w0.3: R11.2 93.65,28.44 USBC1.A5
$1N17: length 5.1
  Top Layer w0.5: R28.1 57.42,31.44 57.72,31.14 D6.2 ; U11.5 59.33,31.01 D6.2 ; D6.2 D7.2
$1N18: length 1.7
  Top Layer w0.5: 55.91,24.38 54.26,24.38 54.19,24.31
$1N19: length 1.6
  Top Layer w0.5: 54.13,32.64 55.72,32.64
$1N29: length 1.9
  Top Layer w0.2: R19.2 81.61,28.77 83.06,28.77 83.19,28.89 U7.6
$1N31: length 8
  Top Layer w0.2: U7.1 83.19,27.56 82.73,28.01 81.03,28.01 80.77,28.27 80.77,28.96 79.76,29.97 78.87,29.97 78.43,30.41 U6.1
$1N32: length 6
  Top Layer w0.2: U7.5 84.14,29.78 83.95,29.97 80.58,29.97 79.92,30.63 U8.1
$1N34: length 2.9
  Top Layer w0.3: U6.2 U8.2 81.3,33 U5.2
$1N35: length 11.5
  Top Layer w0.3: v2(74.87,26.61) R20.1 74.87,27.5 74.17,28.19 73.03,28.19 72.52,28.7 72.52,30.08 73.48,31.04
  Top Layer w0.4: 73.42,31.04 73.42,31.75 73.81,32.14 76.34,32.14 76.72,31.75 Q3.2
$1N37: length 6
  Top Layer w0.5: D3.1 D4.1 57.42,25.99 57.42,24.38 58.12,24.38 58.62,24.88 59.62,24.88
$1N38: length 9.4
  Top Layer w0.3: Q1.3 73.24,20.89 v1(73.5,21.15) ; v1(76.81,25.09) 77.43,25.09 U2.1
  Inner2 w0.3: v1(73.5,21.15) 73.5,24.48 74.11,25.09 v1(76.81,25.09)
$1N39: length 5.7
  Top Layer w0.3: 76.29,22.61 76.55,22.35 76.55,20.52 76.3,20.26 75.79,20.26 75.54,20.02 75.54,19.25 ; Q1.1 75.54,17.87 R12.2
$1N42: length 1.8
  Top Layer w0.3: R1.2 76.36,24.07 U2.2
$1N44: length 28.7
  Top Layer w0.3: 73.43,29.27 D5.2 73.88,29.31 74.24,28.95 R20.2 74.87,30.01 v1(74.84,30.04) 74.82,30.06 Q3.1 ; Q2.1 71.58,30.06 v1(71.56,30.04)
  Inner2 w0.3: SW1.2 80.7,19.25 80.33,19.62 72.01,19.62 71.56,20.07 v1(71.56,30.04) v1(74.84,30.04)
$1N50: length 5.3
  Top Layer w0.4: 69.99,26.95 71.92,26.93 72.36,26.49 72.36,23.7
$1N51: length 1.4
  Top Layer w0.4: 69.99,24.95 69.99,24.85 70.39,24.45 70.39,23.77 U23.6
$1N70: length 3.3
  Top Layer w0.2: 49.25,16.15 49.31,16.2 C11.2 52.33,16.2 U9.5
$1N80: length 4.1
  Top Layer w0.2: U10.5 39.78,28.57 C16.2 39.4,27 38.82,26.42 37.88,26.42
$1N84: length 4.2
  Top Layer w0.2: 53.75,19.63 53.75,18.29 53.44,17.98 U9.4 ; R17.1 55.22,19.63
$1N85: length 3.1
  Top Layer w0.2: U10.4 39.41,30.84 37.88,30.84 R23.1
$1N87: length 1.8
  Top Layer w0.3: SW1.3 78.51,17.76 76.93,17.76
$1N88: length 9.8
  Top Layer w0.2: R4.1 77.3,28.95 Q6.1 78.2,29.15 78.65,28.71 78.65,26.68 79.09,26.23 79.09,24.06 80.7,22.45
$1N8838: length 3.4
  Top Layer w0.2: C69.2 46,24.71 47.15,25.86 L4.4
  Top Layer w0.5: L1.1 45.83,24.7 C69.2
$1N8925: length 3.5
  Top Layer w0.2: 45.85,32.45 47.15,31.14 L5.1
  Top Layer w0.5: L2.1 45.84,32.45 C68.2
$2N9: length 8.8
  Top Layer w0.2: 74.96,8.47 74.96,8.14 75.08,8.01 78.32,8.01 78.42,7.77 ; C44.2 78.42,9.06 78.42,7.77 ; 79.97,5.98 79.91,6.04 R58.2 78.38,7.61 ; 78.42,7.77 R47.1 78.42,7.73 78.42,7.77
$2N10: length 13.6
  Top Layer w0.2: 60.4,8.38 60.46,8.33 62.18,8.33 ; R56.2 arc(62.37,8.1) 62.6,8 65.6,8 arc(65.79,8.08) 65.88,8.28 U17.1 65.88,9.74 arc(65.98,9.99) 66.23,10.1 67.06,10.1 arc(67.33,9.98) 67.44,9.72 67.44,6.6 arc(67.55,6.33) 67.82,6.22 68.55,6.22 arc(68.55,6.22) R49.1
$2N11: length 44.6
  Top Layer w0.2: C33.1 38.02,7.94 R41.2 arc(39.77,7.72) 40,7.62 43.05,7.62 arc(43.25,7.7) 43.32,7.89 U15.1 43.32,9.23 arc(43.43,9.48) 43.69,9.59 44.58,9.59 arc(44.85,9.48) 44.96,9.21 44.96,7.94 arc(45.07,7.67) 45.34,7.56 49.15,7.56 arc(49.55,7.39) 49.72,6.98 49.72,3.11 arc(49.87,2.75) 50.23,2.6 68.77,2.6 arc(69.17,2.77) 69.34,3.17 69.34,7.43 arc(69.43,7.65) 69.66,7.75
$2N13: length 7.2
  Top Layer w0.2: R46.2 R40.1 69.11,9.28 69.31,9.08 69.31,8.7 69.5,8.51 71.18,8.51 71.63,8.95 73.06,8.95 73.06,8.47
$2N15: length 13.7
  Top Layer w0.2: 73.09,6.73 73.09,6.79 arc(73.18,7.02) 73.41,7.11 76.96,7.11 arc(77.28,6.98) 77.41,6.67 77.41,4.83 arc(77.49,4.62) 77.7,4.53 R58.1 ; 73.06,6.16 73.07,6.17 73.07,6.75 73.06,6.76 arc(72.95,7.01) 72.71,7.11 71.63,7.11 arc(71.36,7) 71.25,6.73 71.25,6.67 arc(71.14,6.4) 70.87,6.29 70.12,6.29 arc(70.08,6.27) R49.2 ; 78.42,4.58 79.97,4.58
$2N40: length 3.6
  Top Layer w0.2: R45.2 28.65,29.54 arc(28.37,30.21) C32.2
$2N44: length 5.3
  Top Layer w0.3: R35.1 C24.2 4.44,21.13 R82.2
$2N45: length 5.4
  Top Layer w0.3: R83.2 4.49,13.8 arc(4.73,13.7) C40.2 R62.1
$2N46: length 1.3
  Top Layer w0.2: R59.2 R52.1
$2N47: length 5.1
  Top Layer w0.2: R48.1 29.46,14.99 arc(30,14.77) 30.22,14.23 R52.2
$2N48: length 6.4
  Top Layer w0.3: R63.1 9.78,13.46 ; C40.1 C41.2 ; R62.2 7.78,13.46
$2N50: length 6.4
  Top Layer w0.3: 12.74,11.27 12.74,13.46 ; C41.1 C42.2 ; 14.74,11.27 14.74,13.46
$2N51: length 10.8
  Top Layer w0.3: R64.2 17.7,13.46 ; C42.1 17.7,14.65 arc(17.83,14.98) 18.16,15.11 20.76,15.11 arc(21.08,14.98) 21.21,14.67 21.21,13.47 arc(21.21,13.47) C43.2 ; R65.1 21.2,13.46
$2N55: length 5.2
  Top Layer w0.2: R48.3 29.46,20.07 arc(29.95,20.27) 30.15,20.76 R42.1
$2N56: length 1.3
  Top Layer w0.2: R39.1 R42.2
$2N57: length 10.7
  Top Layer w0.3: R38.1 21.2,21.51 ; R37.2 C26.1 17.7,20.4 arc(17.87,19.99) 18.29,19.81 20.7,19.81 arc(21.06,19.96) 21.21,20.32 21.21,21.49 arc(21.21,21.5) C27.2
$2N58: length 6.3
  Top Layer w0.3: 12.74,23.65 12.74,21.51 ; C25.1 C26.2 ; 14.74,23.65 14.74,21.51
$2N60: length 6.3
  Top Layer w0.3: R35.2 7.78,21.51 ; R36.1 9.78,21.51 ; C24.1 C25.2
$2N70: length 17.9
  Top Layer w0.2: 84.94,12.52 84.94,11.63
  Inner2 w0.3: 84.94,11.63 84.94,10.07 83.12,8.25 83.12,5.27 84.01,4.38 90.55,4.38 91.09,3.84 SW2.6
  vias: v1(84.93,11.63)
$2N71: length 6.6
  Top Layer w0.2: 83.22,10.48 83.92,9.72 86.59,9.72 87.09,9.22 87.09,7.01
$2N72: length 8.7
  Top Layer w0.2: 84.94,10.48 86.91,10.48 87.67,9.72 87.67,8.64 88.11,8.2 90.78,8.2 91.09,7.88 SW2.3
$2N74: length 1.5
  Top Layer w0.2: 83.22,7.47 83.22,8.97
$2N75: length 1.5
  Top Layer w0.2: 84.93,7.47 84.94,8.97
$2N78: length 8.4
  Top Layer w0.2: R74.2 93.44,6.05 93.44,7.56 91.73,9.28 90.97,9.28 89.57,10.68 89.57,12.11 89.41,12.27
$2N83: length 9.5
  Top Layer w0.2: 87.95,13.53 91.1,13.53 91.31,13.32 91.31,12.27 92.44,12.27 92.71,12 92.71,9.53 92.96,9.27 93.61,9.27
$2N86: length 2.7
  Top Layer w0.2: 96.58,10.79 96.58,11.56 97.09,12.06 U20.1
$2N88: length 3.7
  Top Layer w0.2: 95.12,9.27 93.61,10.8 93.61,12.08 93.41,12.27
$2N90: length 1.6
  Top Layer w0.3: Q4.1 98.41,19.72 U20.3
$2N93: length 11.4
  Top Layer w0.3: U20.4 97.09,20.83 96.41,21.51 Q4.3 95.69,22.16 95.13,22.72 R67.1 89.5,22.72 BZ1.2
$2N95: length 1.4
  Top Layer w0.2: C31.1 27.49,26.03 R44.2
$2N96: length 1.4
  Top Layer w0.2: R53.1 27.5,10.41 27.37,10.29
$2N97: length 1.4
  Top Layer w0.2: 27.31,24.77 27.37,24.7 R43.2
$2N98: length 1.4
  Top Layer w0.2: C38.2 27.54,9.08 R54.1
$2N127: length 3.6
  Top Layer w0.2: R55.1 28.71,5.76 arc(28.42,5.06) C39.2
$2N12440: length 13.6
  Top Layer w0.2: R57.3 53.71,10.16 R84.1 ; R57.3 52.3,9.32 R50.1 C34.2 ; R57.3 arc(53.15,10.16) 53.15,10.17 53.15,11.49 arc(52.98,11.9) 52.58,12.06 46.74,12.06 arc(46.38,11.92) 46.23,11.56 R85.2
$2N12456: length 11.6
  Top Layer w0.2: R57.1 54.23,5.08 arc(54.49,5.19) 54.6,5.45 C70.1 ; R57.1 R57.2 52.3,8.46 R50.2 C34.1 ; R57.1 arc(53.15,5.08) 53.15,5.07 53.15,4.38 arc(53.26,4.12) 53.52,4.01 R86.1
$2N12584: length 6.6
  Top Layer w0.2: Q5.2 96.13,12.12 96.33,12.32 96.33,14.41 96.65,14.73 98.04,14.73 98.36,14.41 U20.2
$2N25458: length 10.9
  Top Layer w0.2: R34.2 40.19,17.66 C29.1 40.19,18.67 39.94,18.92 35.75,18.92 35.43,19.24 35.43,21.08 35.12,21.4 R31.2
$2N25616: length 8.9
  Top Layer w0.2: R78.2 41.66,19.94 41.91,19.69 44.2,19.69 44.51,19.37 44.51,17.66 R79.2 45.72,17.66 46.1,17.27 C66.1
$2N64644: length 7.3
  Top Layer w0.3: R83.1 1.84,4.95 2.54,4.25 U25.1
$2N64659: length 7.2
  Top Layer w0.3: U24.1 2.75,30.75 1.84,29.84 R82.1
$2N64817: length 1.5
  Top Layer w0.2: C70.2 54.61,6.92 R84.2
$2N67075: length 6.8
  Top Layer w0.3: 93.61,17.72 93.61,19.18 88.86,19.18 BZ1.1

## Copper pours and planes (outline as drawn; the poured copper is in the pictures)
+2.5V on Top Layer: 50.16,20.19 50.04,20.07 50.04,18.92 49.66,18.54 49.02,18.54 48.77,18.29 48.77,17.27 48.9,17.14 49.91,17.14 50.04,17.27 50.04,18.03 51.05,19.05 52.58,19.05 52.83,19.3 52.83,20.07 52.71,20.19
+2.5V on Top Layer: 41.15,4.83 41.02,4.7 41.02,3.3 41.28,3.05 43.56,3.05 43.81,3.3 43.81,4.7 43.69,4.83
+2.5V on Top Layer: 72.9,5.08 72.77,4.95 72.77,3.3 73.03,3.05 75.18,3.05 75.44,3.3 75.44,4.95 75.31,5.08
+2.5V on Top Layer: 63.88,5.21 63.75,5.08 63.75,3.43 64.01,3.17 66.17,3.17 66.42,3.43 66.42,5.08 66.29,5.21
+2.5V on Inner2: 32.77,2.41 32.51,2.67 32.51,25.15 32.77,25.4 35.81,25.4 36.07,25.65 36.07,27.81 35.81,28.07 32.77,28.07 32.51,28.32 32.51,31.37 32.77,31.62 39.88,31.62 40.13,31.37 40.13,19.69 40.39,19.43 44.32,19.43 44.58,19.18 44.58,15.62 44.83,15.37 54.48,15.37 54.74,15.62 54.74,21.34 54.48,21.59 46.1,21.59 45.85,21.84 45.85,22.48 45.59,22.73 44.32,22.73 44.07,22.99 44.07,33.66 43.69,33.91 30.86,33.91 30.61,33.66 30.61,1.27 30.86,1.02 35.56,1.02 36.7,1.78 76.58,1.78 76.84,2.03 76.84,4.06 76.58,4.32 34.8,4.32 34.54,4.06 34.54,2.67 34.29,2.41
+4.5V on Top Layer: 46.23,25.65 46.35,25.78 46.35,26.54 46.23,26.67 42.67,26.67 42.54,26.54 42.54,24.26 42.67,24.13 43.43,24.13 43.56,24.26 43.56,25.27 43.43,25.4 42.8,25.4 42.8,25.65
+4.5V on Top Layer: 44.96,23.75 44.83,23.62 44.83,22.61 45.47,21.97 57.53,21.97 57.78,21.72 57.78,16.89 57.53,16.64 56.13,16.64 55.88,16.38 54.61,16.38 54.48,16.26 54.48,15.75 54.61,15.62 58.42,15.62 58.67,15.88 58.67,22.22 58.42,22.48 45.97,22.48 45.72,22.73 45.72,23.62 45.59,23.75
+4.5V on Inner2: 44.96,26.54 44.7,26.29 44.7,23.24 44.96,22.99 45.59,22.99 45.85,23.24 45.85,26.29 45.59,26.54
+5V on Top Layer: 68.58,17.27 68.33,17.53 68.33,18.29 68.58,18.54 69.47,18.54 69.72,18.8 69.72,22.61 69.98,22.86 70.87,22.86 70.99,22.99 70.99,24.26 71.12,24.38 71.63,24.38 71.75,24.26 71.75,22.99 71.88,22.86 73.79,22.86 74.04,23.11 74.04,24.64 75.56,26.16 75.56,27.69 75.82,27.94 77.98,27.94 78.1,27.81 78.1,26.92 77.98,26.8 77.38,26.8 75.31,24.77 75.31,22.22 75.18,22.1 74.29,22.1 74.17,22.22 70.87,22.22 70.74,22.1 70.74,17.53 70.49,17.27
+5V on Top Layer: 82.55,31.88 82.3,31.62 82.3,30.48 82.55,30.23 83.82,30.23 83.95,30.35 83.95,31.62 83.69,31.88
+5V on Top Layer: 74.66,33.98 74.41,33.73 74.41,32.96 74.66,32.71 76.95,32.71 77.2,32.96 77.2,33.73 76.95,33.98
+5V on Inner2: 68.58,17.4 68.33,17.65 68.33,34.04 68.58,34.29 83.95,34.29 84.2,34.04 84.2,30.1 83.95,29.84 82.17,29.84 81.91,30.1 81.91,32.89 81.66,33.15 70.61,33.15 70.36,32.89 70.36,17.65 70.1,17.4
+VCC on Top Layer: 56.02,27.94 55.89,28.07 55,28.07 54.87,27.94 54.87,26.92 54.75,26.8 49.66,26.8 49.4,26.54 49.4,25.53 49.53,25.4 50.42,25.4 50.67,25.65 52.07,25.65 52.2,25.53 52.2,23.88 52.32,23.75 52.97,23.75 53.21,23.88 53.21,25.27 53.47,25.53 55.89,25.53 56.02,25.65
-2.5V on Top Layer: 41.4,11.81 41.15,11.56 41.15,10.16 41.28,10.03 43.69,10.03 43.81,10.16 43.81,11.56 43.56,11.81
-2.5V on Top Layer: 64.64,12.7 64.39,12.45 64.39,10.92 64.52,10.8 67.06,10.8 67.18,10.92 67.18,12.45 66.93,12.7
-2.5V on Top Layer: 73.03,11.56 72.77,11.3 72.77,9.65 72.9,9.53 75.31,9.53 75.44,9.65 75.44,11.3 75.18,11.56
-2.5V on Top Layer: 37.47,25.72 37.34,25.59 37.34,24.51 37.47,24.38 40.13,24.38 40.26,24.51 40.26,25.59 40.2,25.72
-2.5V on Inner2: 42.8,12.45 42.8,10.41 43.05,10.16 83.31,10.16 83.82,10.67 83.82,12.45 83.57,12.7 44.45,12.7 44.2,12.95 44.2,18.92 43.94,19.18 37.97,19.18 37.72,19.43 37.72,23.5 37.97,23.75 38.99,23.75 39.24,24 39.24,30.35 38.99,30.61 34.54,30.61 34.29,30.35 34.29,29.84 34.54,29.59 36.45,29.59 36.7,29.34 36.7,25.53 35.18,24 35.18,17.14 34.93,16.89 33.27,16.89 33.02,16.64 33.02,3.17 33.27,2.92 33.91,2.92 34.16,3.17 34.16,11.68 34.42,11.94 37.85,11.94 38.1,11.68 38.1,10.41 38.35,10.16 41.78,10.16 42.04,10.41 42.04,11.94 41.78,12.19 39.88,12.19 39.62,12.45 39.62,16.51 39.88,16.76 43.18,16.76 43.43,16.51 43.43,13.08
-4.5V on Top Layer: 40.64,33.02 40.51,32.89 40.51,29.59 40.64,29.46 42.16,29.46 42.29,29.59 42.29,31.62 42.16,31.75 40.77,31.75 40.77,31.88 42.42,31.88 42.67,31.62 42.67,30.48 42.8,30.35 46.23,30.35 46.35,30.48 46.35,31.24 46.23,31.37 43.81,31.37 43.56,31.62 43.56,32.89 43.43,33.02
-VCC on Top Layer: 54.99,28.96 54.86,29.08 54.86,29.97 54.61,30.23 49.66,30.23 49.4,30.48 49.4,31.37 49.53,31.5 50.55,31.5 50.8,31.24 52.07,31.24 52.2,31.37 52.2,33.15 52.32,33.27 53.09,33.27 53.21,33.15 53.21,31.75 53.47,31.5 55.75,31.5 56.01,31.24 56.01,29.08 55.88,28.96
GND on Top Layer: 29.75,28.58 29.63,28.46 29.63,24.26 29.75,24.14 30.64,24.14 30.77,24.26 30.77,28.46 30.64,28.58
GND on Top Layer: 46.86,15.62 46.61,15.37 43.69,15.37 43.56,15.24 43.56,14.48 43.81,14.22 53.47,14.22 53.72,14.48 53.72,17.14 53.47,17.4 51.82,17.4 51.56,17.65 51.56,18.03 51.44,18.16 50.55,18.16 50.42,18.03 50.42,17.14 50.55,17.02 51.44,17.02 51.82,16.64 53.09,16.64 53.34,16.38 53.34,15.62 53.09,15.37 48.64,15.37 48.39,15.62 48.39,18.67 48.64,18.92 49.4,18.92 49.66,19.18 49.66,20.19 49.91,20.45 55.75,20.45 56.01,20.19 56.01,17.65 55.75,17.4 54.61,17.4 54.48,17.27 54.48,16.76 54.61,16.64 55.63,16.64 56.01,17.02 57.15,17.02 57.4,17.27 57.4,21.34 57.15,21.59 47.12,21.59 46.86,21.34
GND on Top Layer: 29.88,10.93 29.75,10.8 29.75,5.72 29.88,5.6 30.64,5.6 30.77,5.72 30.77,10.8 30.64,10.93
GND on Top Layer: 42.8,29.84 42.67,29.72 42.67,29.34 42.54,29.21 40.77,29.21 40.64,29.08 40.64,24.26 40.39,24 37.21,24 36.58,24.64 36.58,27.69 37.08,28.19 37.08,31.5 37.21,31.62 40,31.62 40.13,31.75 40.13,32.89 40,33.02 36.32,33.02 36.07,32.77 36.07,23.75 36.32,23.5 41.4,23.5 41.66,23.75 41.66,26.92 41.91,27.18 47.62,27.18 47.75,27.31 47.75,29.72 47.62,29.84
GND on Bottom Layer: 21.08,34.42 20.83,34.16 20.83,26.03 21.08,25.78 24.77,25.78 25.02,25.53 25.02,9.65 24.77,9.4 21.08,9.4 20.83,9.14 20.83,0.89 21.08,0.64 99.06,0.64 99.31,0.89 99.31,14.99 99.06,15.24 59.94,15.24 59.69,15.49 59.69,22.61 59.44,22.86 48.26,22.86 48.01,23.11 48.01,34.16 47.75,34.42
GND on Inner1: 21.08,34.42 20.83,34.16 20.83,26.03 21.08,25.78 24.77,25.78 25.02,25.53 25.02,9.65 24.77,9.4 21.08,9.4 20.83,9.14 20.83,0.89 21.08,0.64 99.06,0.64 99.31,0.89 99.31,14.99 99.06,15.24 59.94,15.24 59.69,15.49 59.69,22.61 59.44,22.86 48.26,22.86 48.01,23.11 48.01,34.16 47.75,34.42
PGND on Top Layer: 79.88,26.29 79.88,23.88 80.14,23.62 81.91,23.62 82.17,23.88 82.17,27.56 82.04,27.69 81.15,27.69 81.03,27.56 81.03,26.92 80.65,26.54 80.17,26.55
PGND on Top Layer: 69.34,32.13 69.09,31.94 69.09,30.61 69.34,30.35 70.61,30.35 70.87,30.61 70.87,31.88 70.61,32.13
PGND on Top Layer: 85.98,29.72 85.72,29.46 85.72,28.58 85.47,28.32 84.07,28.32 83.82,28.07 83.82,26.29 83.95,26.16 84.33,26.16 84.46,26.29 84.46,27.43 84.71,27.69 85.85,27.69 86.23,28.07 88.01,28.07 88.26,28.32 88.26,29.46 88.01,29.72
PGND on Top Layer: 71.12,21.97 70.99,21.84 70.99,17.53 71.25,17.27 74.42,17.27 74.55,17.4 74.55,18.42 74.42,18.54 72.77,18.54 72.52,18.8 72.52,20.45 72.39,20.57 71.88,20.57 71.75,20.7 71.75,21.84 71.63,21.97
PGND on Top Layer: 65.57,21.73 65.57,19.57 67.94,19.56 68.2,19.81 68.2,21.46 67.94,21.72
PGND on Top Layer: 85.09,32.26 84.84,32 84.84,31.24 85.09,30.99 88.01,30.99 88.26,31.24 88.26,32 88.01,32.26
PGND on Bottom Layer: 88.01,34.42 88.26,34.16 88.26,23.88 88.52,23.62 99.06,23.62 99.31,23.37 99.31,17.4 99.06,17.14 65.66,17.14 65.41,17.4 65.41,22.61 65.66,22.86 67.94,22.86 68.2,23.11 68.2,34.16 68.45,34.42
PGND on Inner1: 88.01,34.42 88.26,34.16 88.26,23.88 88.52,23.62 99.06,23.62 99.31,23.37 99.31,17.4 99.06,17.14 65.66,17.14 65.41,17.4 65.41,22.61 65.66,22.86 67.94,22.86 68.2,23.11 68.2,34.16 68.45,34.42
SGND on Top Layer: 49.53,29.84 49.4,29.72 49.4,27.31 49.53,27.18 54.48,27.18 54.61,27.31 54.61,29.72 54.48,29.84
SGND on Top Layer: 58.67,29.46 58.55,29.34 58.55,26.54 58.67,26.42 60.2,26.42 60.32,26.54 60.32,29.34 60.2,29.46
SGND on Top Layer: 60.83,21.72 60.58,21.46 60.58,19.81 60.83,19.56 63.15,19.57 63.15,21.73
SGND on Bottom Layer: 49.02,23.88 49.28,23.62 60.2,23.62 60.45,23.37 60.45,19.69 60.71,19.43 63.12,19.43 63.37,19.69 63.37,26.03 63.12,26.29 61.34,26.29 61.09,26.54 61.09,34.16 60.83,34.42 49.28,34.42 49.02,34.16
SGND on Inner1: 49.02,23.88 49.28,23.62 60.2,23.62 60.45,23.37 60.45,19.69 60.71,19.43 63.12,19.43 63.37,19.69 63.37,26.03 63.12,26.29 61.34,26.29 61.09,26.54 61.09,34.16 60.83,34.42 49.28,34.42 49.02,34.16
SGND on Inner2: 49.02,23.88 49.28,23.62 60.2,23.62 60.45,23.37 60.45,19.69 60.71,19.43 63.12,19.43 63.37,19.69 63.37,26.03 63.12,26.29 61.34,26.29 61.09,26.54 61.09,34.16 60.83,34.42 49.28,34.42 49.02,34.16
VBUS on Top Layer: 82.93,34.42 82.68,34.16 82.68,32.89 82.93,32.64 88.01,32.64 88.26,32.89 88.26,34.16 88.01,34.42
VCC_BIAS on Top Layer: 32.64,29.34 32.51,29.21 32.51,28.45 32.64,28.32 35.18,28.32 35.31,28.45 35.31,29.21 35.18,29.34
VSS_BIAS on Top Layer: 32.64,32.77 32.51,32.64 32.51,31.88 32.64,31.75 35.18,31.75 35.31,31.88 35.31,32.64 35.18,32.77
BAT+ on Top Layer: 71.3,33.98 71.04,33.73 71.04,32.2 71.3,31.95 72.57,31.95 73.33,32.84 73.33,33.73 73.08,33.98
BAT+ on Top Layer: 82.68,25.78 82.42,25.53 82.42,23.88 82.68,23.62 84.84,23.62 85.09,23.88 85.09,25.65 84.74,25.79
BAT+ on Inner2: 71.12,32.77 70.87,32.51 70.87,31.88 71.12,31.62 79.76,31.62 80.01,31.37 80.01,28.45 80.26,28.19 82.04,28.19 82.3,27.94 82.3,23.88 82.55,23.62 84.58,23.62 84.84,23.88 84.84,29.21 84.58,29.46 81.79,29.46 81.53,29.72 81.53,32.51 81.28,32.77
BAT_CHRG on Top Layer: 80.14,26.92 80.39,27.18 80.39,28.58 80.26,28.7 79.25,28.7 79.12,28.58 79.12,27.18 79.38,26.92
EGND on Top Layer: 89.03,32.26 88.77,32 88.77,25.15 89.79,24.13 99.06,24.13 99.31,24.38 99.31,34.16 99.06,34.42 92.84,34.42 92.58,34.16 92.58,33.02 92.96,32.51 92.96,31.24 93.09,31.11 96.01,31.11 96.27,30.86 96.27,26.99 96.01,26.73 93.09,26.73 92.65,26.29 90.55,26.29 90.3,26.54 90.3,30.86 90.55,31.11 91.57,31.11 91.69,31.24 91.69,32.13 91.57,32.26
EGND on Bottom Layer: 89.03,34.42 88.77,34.16 88.77,24.38 89.03,24.13 99.06,24.13 99.31,24.38 99.31,34.16 99.06,34.42
EGND on Inner1: 89.03,34.42 88.77,34.16 88.77,24.38 89.03,24.13 99.06,24.13 99.31,24.38 99.31,34.16 99.06,34.42
EGND on Inner2: 89.03,34.42 88.77,34.16 88.77,24.38 89.03,24.13 99.06,24.13 99.31,24.38 99.31,34.16 99.06,34.42
$1N17 on Top Layer: 57.02,33.27 56.9,33.15 56.9,28.96 57.02,28.83 58.17,28.83 58.29,28.96 58.29,29.72 58.42,29.84 60.07,29.84 60.32,30.1 60.32,33.02 60.07,33.27
$1N18 on Top Layer: 56.27,23.75 56.4,23.88 56.4,24.77 56.27,24.89 53.73,24.89 53.6,24.77 53.6,23.88 53.73,23.75
$1N19 on Top Layer: 53.72,33.27 53.59,33.15 53.59,32.26 53.72,32.13 56.26,32.13 56.39,32.26 56.39,33.15 56.26,33.27
$1N34 on Top Layer: 78.1,33.53 77.85,33.27 77.85,32.64 78.1,32.39 81.66,32.39 81.91,32.64 81.91,33.27 81.66,33.53
$1N35 on Top Layer: 73.39,32.46 72.88,31.95 72.88,30.55 73.01,30.42 73.9,30.42 74.03,30.55 74.03,31.69 74.16,31.82 76.06,31.82 76.19,31.69 76.19,30.55 76.31,30.42 77.2,30.42 77.33,30.55 77.33,32.2 77.08,32.46
$1N37 on Top Layer: 60.32,24 60.07,23.75 57.02,23.75 56.9,23.88 56.9,27.94 57.02,28.07 58.17,28.07 58.29,27.94 58.29,25.65 58.55,25.4 60.2,25.4 60.32,25.27
$1N50 on Top Layer: 69.22,27.43 69.09,27.31 69.09,26.54 69.22,26.42 71.63,26.42 72.01,26.03 72.01,23.24 72.14,23.11 72.64,23.11 72.77,23.24 72.77,26.67 72.01,27.43
$1N51 on Top Layer: 70.68,23.11 69.22,23.11 69.09,23.24 69.09,25.4 69.22,25.53 70.61,25.53 70.74,25.4 70.74,23.18
$1N70 on Top Layer: 48.9,16.64 48.77,16.51 48.77,15.75 48.9,15.62 52.96,15.62 53.09,15.75 53.09,16.26 52.96,16.38 51.69,16.38 51.44,16.64
$1N80 on Top Layer: 38.99,29.21 38.86,29.08 38.86,27.05 38.74,26.92 37.47,26.92 37.34,26.8 37.34,26.1 37.47,25.97 40.13,25.97 40.26,26.1 40.26,29.08 40.13,29.21
$1N8838 on Top Layer: 44.07,24.13 43.94,24.26 43.94,25.15 44.07,25.27 46.23,25.27 46.61,25.65 46.61,26.54 46.74,26.67 47.62,26.67 47.75,26.54 47.75,25.53 47.62,25.4 46.86,25.4 46.48,25.02 46.48,24.26 46.35,24.13
$1N8925 on Top Layer: 44.07,33.02 43.94,32.89 43.94,31.88 44.07,31.75 46.23,31.75 46.61,31.37 46.61,30.48 46.74,30.35 47.62,30.35 47.75,30.48 47.75,31.37 47.62,31.5 46.99,31.5 46.48,32 46.48,32.89 46.35,33.02

Small or netless copper shapes (teardrops, artwork), in the pictures only: 9 on Top Layer

## Text on the board
Bottom Silkscreen Layer: 2024-07-15 | adminismk | By AISS | SGM8061 | 高压差分探头
Top Silkscreen Layer: 250X | 500X | - | +
